# EAGLE schematic Remote_Control_Wiring (EAGLE 7.1.0)
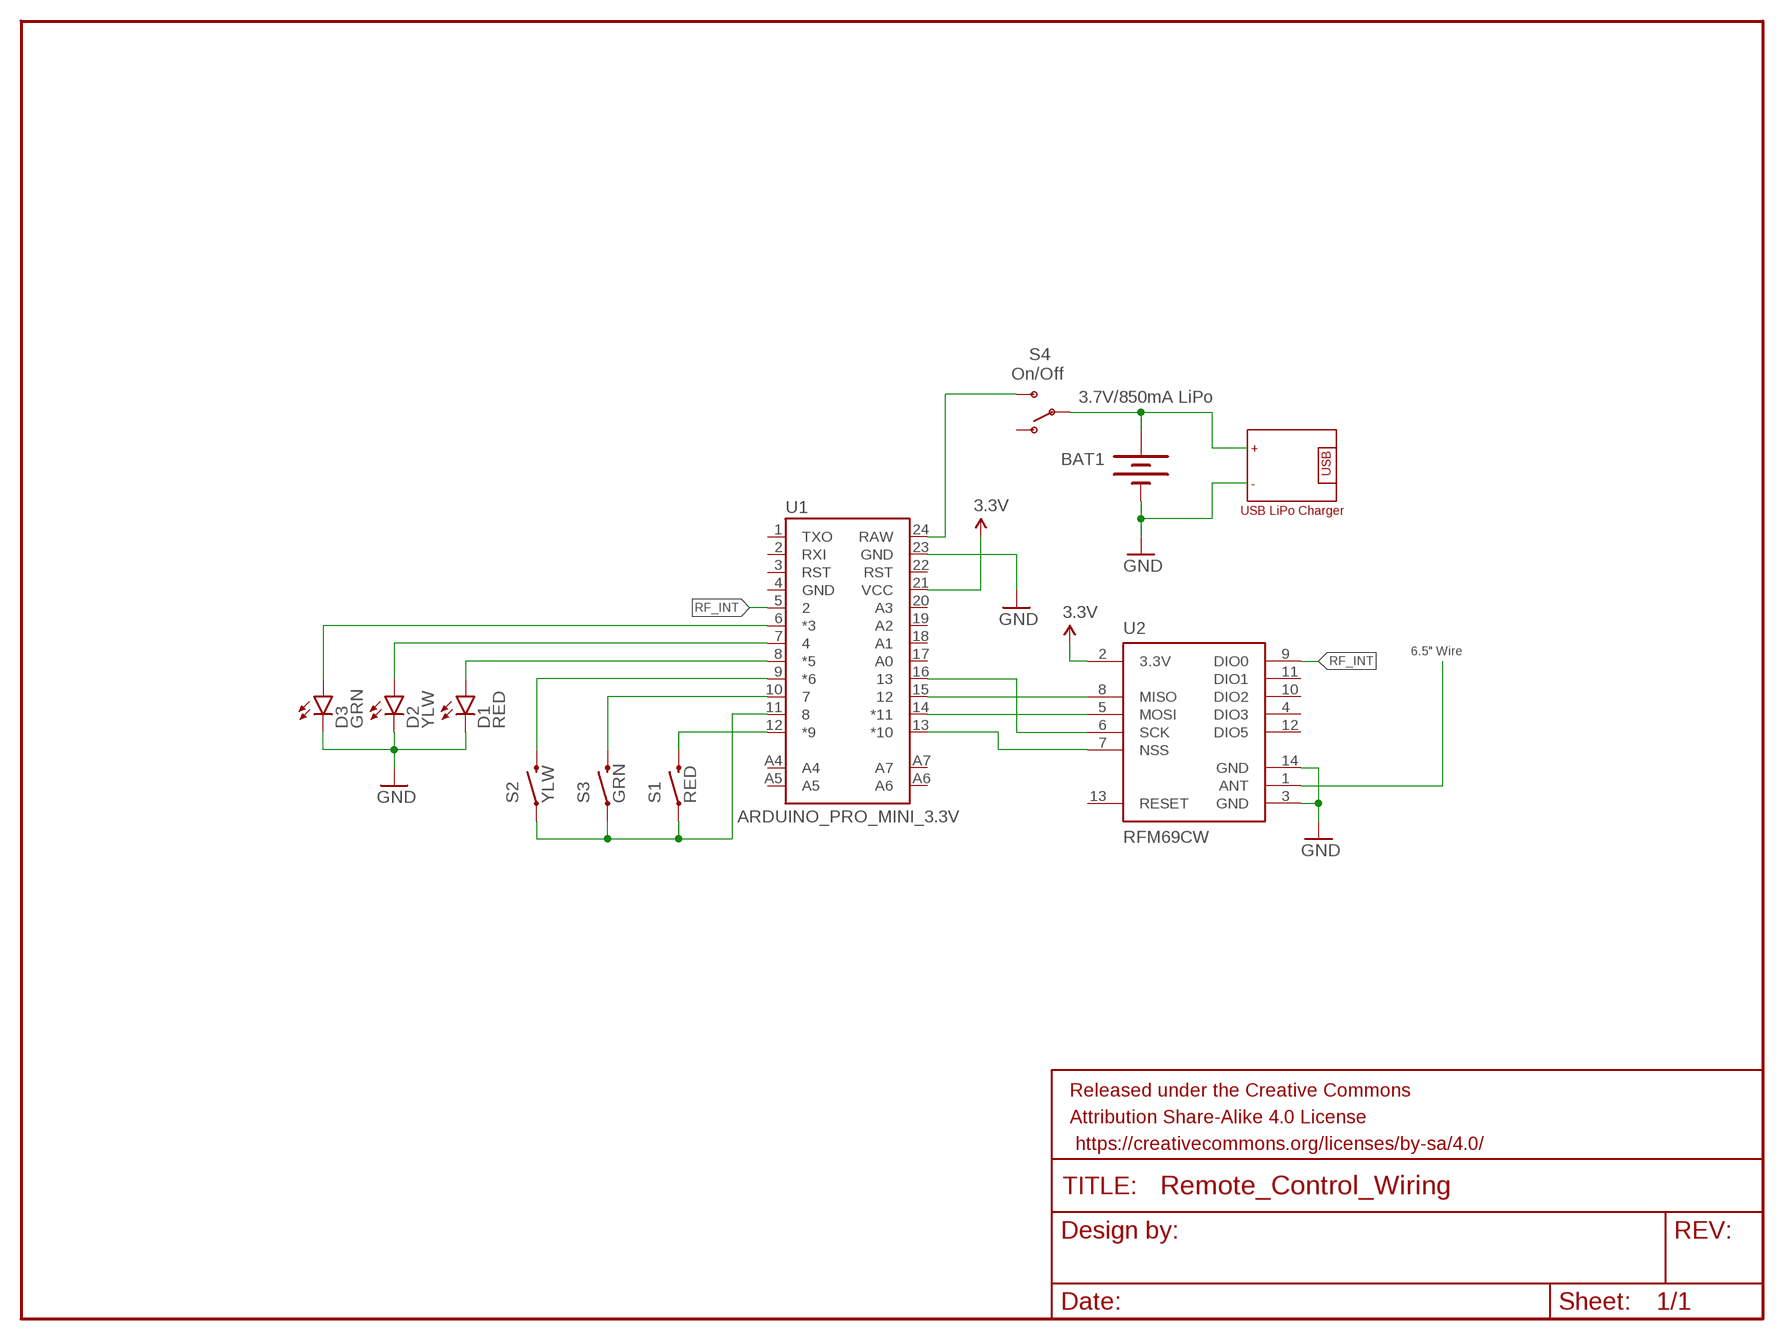
[diagram p0: schematic, sheet 1]

## Parts
BAT1  3.7V/850mA LiPo  BATTERYLIPO-TABS  [LIPO-110-TABS]
D1  RED  LED5MM  [LED5MM]
D2  YLW  LED5MM  [LED5MM]
D3  GRN  LED5MM  [LED5MM]
FRAME1  FRAME-LETTER  [CREATIVE_COMMONS]
S1  RED  SWITCH-MOMENTARY-2PTH  [TACTILE-PTH]
S2  YLW  SWITCH-MOMENTARY-2PTH  [TACTILE-PTH]
S3  GRN  SWITCH-MOMENTARY-2PTH  [TACTILE-PTH]
S4  On/Off  SWITCH-SPDTPTH  [SWITCH-SPDT]
U1  ARDUINO_PRO_MINI_3.3V  ARDUINO_PRO_MINI  [ARDUINO_PRO_MINI]
U2  RFM69CW  [RFM69CW-XXXS2]

## Nets
3.3V: U1.21(VCC) U2.2(3.3V)
GND: BAT1.- D1.K(C) D2.K(C) D3.K(C) U1.23(GND) U2.3(GND) U2.14(GND)
N$1: S1.3 U1.12(*9)
N$2: S3.3 U1.10
N$4: S2.3 U1.9(*6)
N$5: D1.A U1.8(*5)
N$6: D2.A U1.7
N$7: D3.A U1.6(*3)
N$8: S1.1 S2.1 S3.1 U1.11
N$9: U1.15 U2.8(MISO)
N$10: U1.14(*11) U2.5(MOSI)
N$11: U1.16 U2.6(SCK)
N$12: U1.13(*10) U2.7(NSS)
N$13: U2.1(ANT)
N$14: S4.3(S) U1.24(RAW)
N$15: BAT1.+ S4.2(P)
RF_INT: U1.5 U2.9(DIO0)
Unconnected: S4.1(O) U1.1(TXO) U1.2(RXI) U1.3(RST) U1.4(GND) U1.17(A0) U1.18(A1) U1.19(A2) U1.20(A3) U1.22(RST) U1.A4 U1.A5 U1.A6 U1.A7 U2.4(DIO3) U2.10(DIO2) U2.11(DIO1) U2.12(DIO5) U2.13(RESET)

## Notes on the sheet
- +
- USB
- -
- USB LiPo Charger
- 6.5" Wire

## Library data of the parts
BAT1 = SparkFun-Electromechanical:BATTERY: Battery Holders Various common sizes : AA, AAA, 18650 (PRT-12895), 20mm coin cell and 12mm coin cell. 20MM_4LEGS, BATT-10373
D1-D3 = SparkFun-LED:LED: LEDs Standard schematic elements and footprints for 5mm, 3mm, 1206, and 0603 sized LEDs. 5mm - Spark Fun Electronics SKU : COM-00529 (and others)
FRAME1 = SparkFun-Aesthetics:FRAME-LETTER: Schematic Frame Standard 8.5x11 US Letter frame
S1-S3 = SparkFun-Electromechanical:SWITCH-MOMENTARY-2: Various NO switches- pushbuttons, reed, etc; PROD_ID: SWCH-08441
S4 = SparkFun-Electromechanical:SWITCH-SPDT: SPDT Switch Simple slide switch, Spark Fun Electronics SKU : COM-00102 DPDT SMT slide switch, AYZ0202, SWCH-08179; PROD_ID: SWCH-08261
U1 = SparkFun-Boards:ARDUINO_PRO_MINI
U2 = SparkFun-RF:RFM69